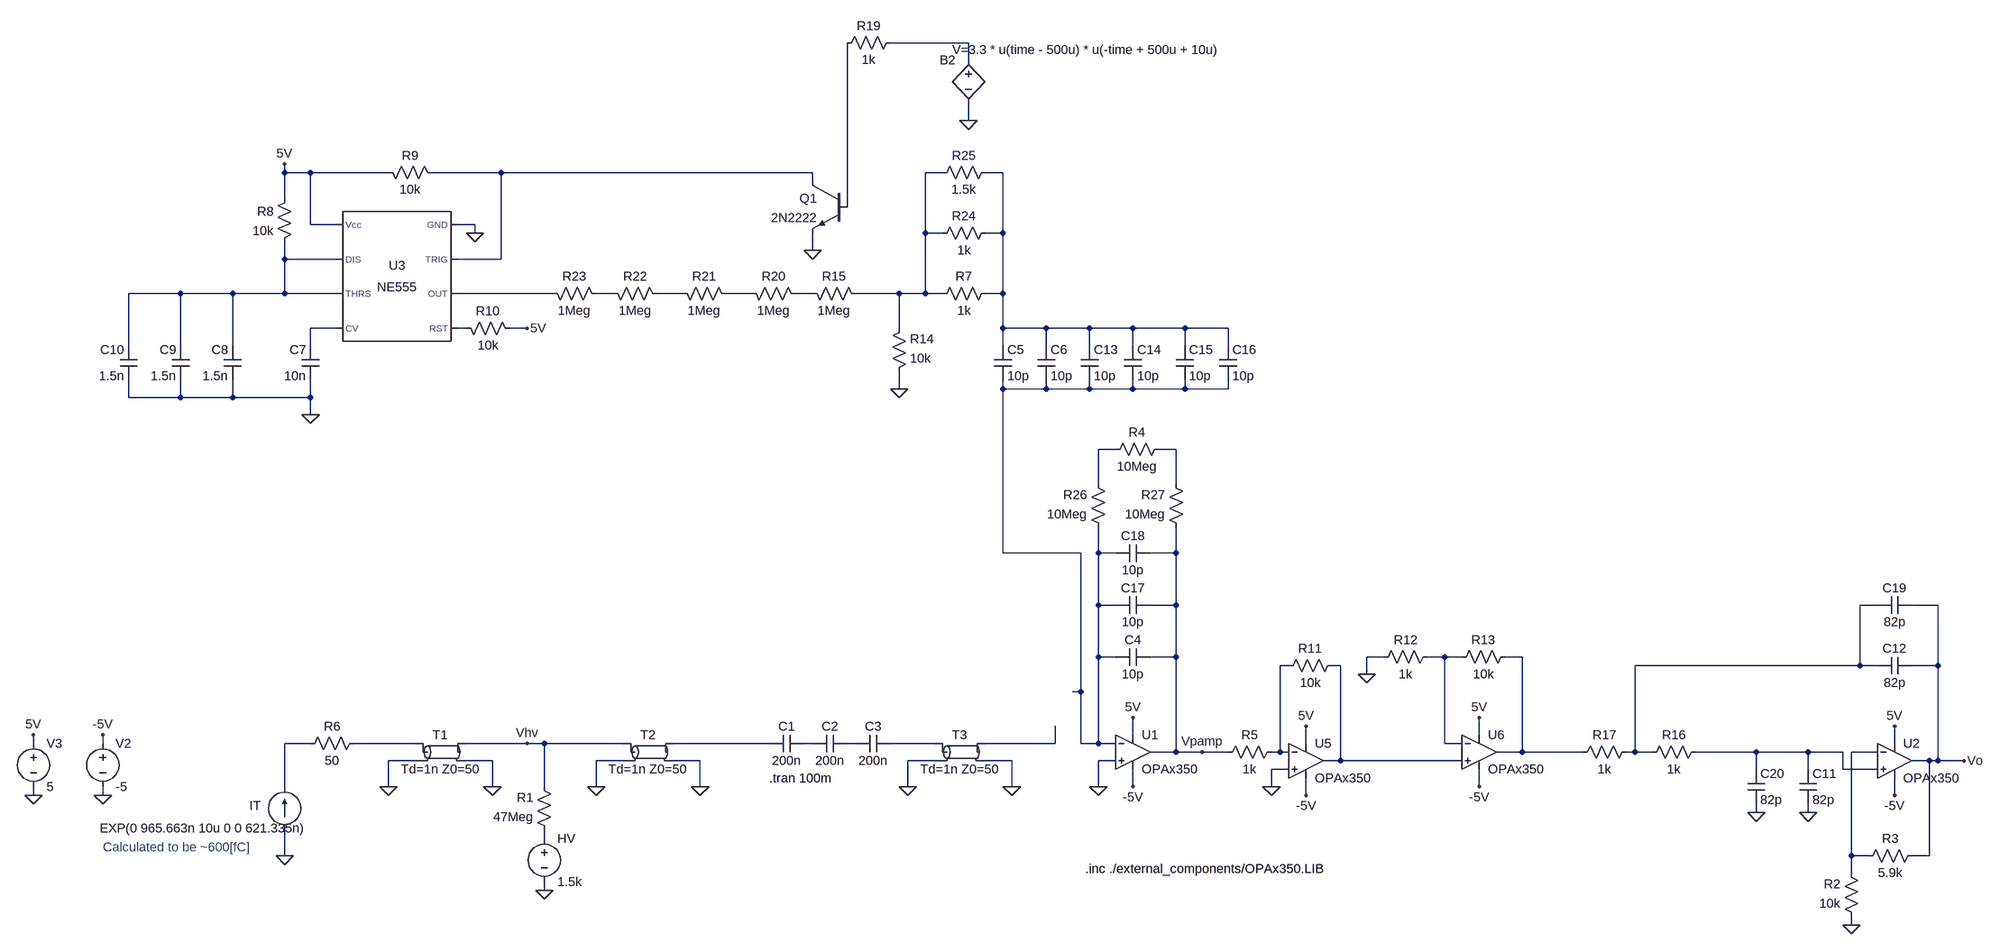
[diagram p0: schematic analog_section.asc]
analog_section.asc, the LTspice schematic file:
Version 4
SHEET 1 2996 820
WIRE 160 -1296 16 -1296
WIRE 160 -1264 160 -1296
WIRE 160 -1152 160 -1184
WIRE -1104 -1056 -1104 -1072
WIRE -1056 -1056 -1104 -1056
WIRE -912 -1056 -1056 -1056
WIRE -704 -1056 -832 -1056
WIRE -128 -1056 -704 -1056
WIRE 112 -1056 80 -1056
WIRE 224 -1056 192 -1056
WIRE -128 -1040 -128 -1056
WIRE -1104 -1008 -1104 -1056
WIRE -64 -992 -64 -1296
WIRE -1056 -960 -1056 -1056
WIRE -1008 -960 -1056 -960
WIRE -752 -960 -784 -960
WIRE -752 -944 -752 -960
WIRE 80 -944 80 -1056
WIRE 112 -944 80 -944
WIRE 224 -944 224 -1056
WIRE 224 -944 192 -944
WIRE -128 -912 -128 -944
WIRE -1104 -896 -1104 -928
WIRE -1008 -896 -1104 -896
WIRE -704 -896 -704 -1056
WIRE -704 -896 -784 -896
WIRE -1296 -832 -1392 -832
WIRE -1200 -832 -1296 -832
WIRE -1104 -832 -1104 -896
WIRE -1104 -832 -1200 -832
WIRE -1008 -832 -1104 -832
WIRE -608 -832 -784 -832
WIRE -496 -832 -528 -832
WIRE -368 -832 -416 -832
WIRE -240 -832 -288 -832
WIRE -128 -832 -160 -832
WIRE 32 -832 -48 -832
WIRE 80 -832 80 -944
WIRE 80 -832 32 -832
WIRE 112 -832 80 -832
WIRE 224 -832 224 -944
WIRE 224 -832 192 -832
WIRE -1008 -768 -1056 -768
WIRE -768 -768 -784 -768
WIRE -656 -768 -688 -768
WIRE 32 -768 32 -832
WIRE 224 -768 224 -832
WIRE 304 -768 224 -768
WIRE 384 -768 304 -768
WIRE 464 -768 384 -768
WIRE 560 -768 464 -768
WIRE 640 -768 560 -768
WIRE -1392 -736 -1392 -832
WIRE -1296 -736 -1296 -832
WIRE -1200 -736 -1200 -832
WIRE -1056 -736 -1056 -768
WIRE 224 -736 224 -768
WIRE 304 -736 304 -768
WIRE 384 -736 384 -768
WIRE 464 -736 464 -768
WIRE 560 -736 560 -768
WIRE 640 -736 640 -768
WIRE 32 -656 32 -688
WIRE 224 -656 224 -672
WIRE 304 -656 304 -672
WIRE 304 -656 224 -656
WIRE 384 -656 384 -672
WIRE 384 -656 304 -656
WIRE 464 -656 464 -672
WIRE 464 -656 384 -656
WIRE 560 -656 560 -672
WIRE 560 -656 464 -656
WIRE 640 -656 640 -672
WIRE 640 -656 560 -656
WIRE -1392 -640 -1392 -672
WIRE -1296 -640 -1296 -672
WIRE -1296 -640 -1392 -640
WIRE -1200 -640 -1200 -672
WIRE -1200 -640 -1296 -640
WIRE -1056 -640 -1056 -672
WIRE -1056 -640 -1200 -640
WIRE -1056 -608 -1056 -640
WIRE 432 -544 400 -544
WIRE 544 -544 512 -544
WIRE 400 -480 400 -544
WIRE 544 -480 544 -544
WIRE 224 -352 224 -656
WIRE 368 -352 224 -352
WIRE 400 -352 400 -400
WIRE 432 -352 400 -352
WIRE 544 -352 544 -400
WIRE 544 -352 496 -352
WIRE 400 -256 400 -352
WIRE 432 -256 400 -256
WIRE 544 -256 544 -352
WIRE 544 -256 496 -256
WIRE 1840 -256 1808 -256
WIRE 1952 -256 1904 -256
WIRE 400 -160 400 -256
WIRE 432 -160 400 -160
WIRE 544 -160 544 -256
WIRE 544 -160 496 -160
WIRE 928 -160 896 -160
WIRE 1040 -160 1008 -160
WIRE 1072 -160 1040 -160
WIRE 1184 -160 1152 -160
WIRE 752 -144 736 -144
WIRE 848 -144 832 -144
WIRE 1808 -144 1808 -256
WIRE 1808 -144 1392 -144
WIRE 1840 -144 1808 -144
WIRE 1952 -144 1952 -256
WIRE 1952 -144 1904 -144
WIRE 896 -128 896 -160
WIRE 368 -96 368 -352
WIRE 368 -96 352 -96
WIRE 464 -16 464 -48
WIRE 1104 -16 1104 -48
WIRE -1568 0 -1568 -16
WIRE -1440 0 -1440 -16
WIRE -1056 0 -1104 0
WIRE -864 0 -976 0
WIRE -656 0 -768 0
WIRE -624 0 -656 0
WIRE -480 0 -624 0
WIRE -208 0 -384 0
WIRE -128 0 -144 0
WIRE -48 0 -64 0
WIRE 96 0 16 0
WIRE 320 0 320 -32
WIRE 320 0 192 0
WIRE 368 0 368 -96
WIRE 400 0 400 -160
WIRE 400 0 368 0
WIRE 432 0 400 0
WIRE 784 0 784 -32
WIRE 1040 0 1040 -160
WIRE 1072 0 1040 0
WIRE 1872 0 1872 -32
WIRE 544 16 544 -160
WIRE 544 16 496 16
WIRE 592 16 544 16
WIRE 640 16 592 16
WIRE 736 16 736 -144
WIRE 736 16 720 16
WIRE 752 16 736 16
WIRE 1184 16 1184 -160
WIRE 1184 16 1136 16
WIRE 1296 16 1184 16
WIRE 1392 16 1392 -144
WIRE 1392 16 1376 16
WIRE 1424 16 1392 16
WIRE 1616 16 1504 16
WIRE 1712 16 1616 16
WIRE 1776 16 1712 16
WIRE 1840 16 1792 16
WIRE -864 32 -912 32
WIRE -720 32 -768 32
WIRE -480 32 -528 32
WIRE -336 32 -384 32
WIRE 96 32 48 32
WIRE 240 32 192 32
WIRE 432 32 400 32
WIRE 848 32 848 -144
WIRE 848 32 816 32
WIRE 1072 32 848 32
WIRE 1936 32 1904 32
WIRE 1952 32 1952 -144
WIRE 1952 32 1936 32
WIRE 2000 32 1952 32
WIRE 752 48 720 48
WIRE 1616 48 1616 16
WIRE 1712 48 1712 16
WIRE 1776 48 1776 16
WIRE 1840 48 1776 48
WIRE -1104 80 -1104 0
WIRE -912 80 -912 32
WIRE -720 80 -720 32
WIRE -624 80 -624 0
WIRE -528 80 -528 32
WIRE -336 80 -336 32
WIRE 48 80 48 32
WIRE 240 80 240 32
WIRE 400 80 400 32
WIRE 464 80 464 48
WIRE 720 80 720 48
WIRE 1104 80 1104 48
WIRE -1568 96 -1568 80
WIRE -1440 96 -1440 80
WIRE 784 96 784 64
WIRE 1872 96 1872 64
WIRE 1616 128 1616 112
WIRE 1712 128 1712 112
WIRE -624 176 -624 160
WIRE -1104 208 -1104 160
WIRE 1792 208 1792 16
WIRE 1824 208 1792 208
WIRE 1936 208 1936 32
WIRE 1936 208 1904 208
WIRE 1792 240 1792 208
WIRE -624 272 -624 256
WIRE 1792 336 1792 320
FLAG -624 272 0
FLAG -1104 208 0
FLAG -336 80 0
FLAG -528 80 0
FLAG -720 80 0
FLAG -912 80 0
FLAG 240 80 0
FLAG 48 80 0
FLAG -656 0 Vhv
FLAG 400 80 0
FLAG -1440 96 0
FLAG -1440 -16 -5V
FLAG 720 80 0
FLAG 896 -128 0
FLAG -1056 -608 0
FLAG -752 -944 0
FLAG -1104 -1072 5V
FLAG -656 -768 5V
FLAG -1568 96 0
FLAG -1568 -16 5V
FLAG 160 -1152 0
FLAG 32 -656 0
FLAG -128 -912 0
FLAG 592 16 Vpamp
FLAG 2000 32 Vo
FLAG 1792 336 0
FLAG 1712 128 0
FLAG 1616 128 0
FLAG 1104 -48 5V
FLAG 784 -32 5V
FLAG 464 -48 5V
FLAG 464 80 -5V
FLAG 784 96 -5V
FLAG 1104 80 -5V
FLAG 1872 96 -5V
FLAG 1872 -32 5V
SYMBOL voltage -624 160 R0
WINDOW 123 0 0 Left 0
WINDOW 39 0 0 Left 0
SYMATTR InstName HV
SYMATTR Value 1.5k
SYMBOL current -1104 160 R180
WINDOW 0 54 29 Top 2
WINDOW 3 151 19 Bottom 2
WINDOW 123 0 0 Left 0
WINDOW 39 0 0 Left 0
SYMATTR InstName IT
SYMATTR Value EXP(0 965.663n 10u 0 0 621.335n)
SYMBOL res -608 176 R180
WINDOW 0 36 76 Left 2
WINDOW 3 36 40 Left 2
SYMATTR InstName R1
SYMATTR Value 47Meg
SYMBOL cap 432 -144 R270
WINDOW 0 32 32 VTop 2
WINDOW 3 0 32 VBottom 2
SYMATTR InstName C4
SYMATTR Value 10p
SYMBOL cap -208 16 R270
WINDOW 0 32 32 VTop 2
WINDOW 3 0 32 VBottom 2
SYMATTR InstName C1
SYMATTR Value 200n
SYMBOL cap -128 16 R270
WINDOW 0 32 32 VTop 2
WINDOW 3 0 32 VBottom 2
SYMATTR InstName C2
SYMATTR Value 200n
SYMBOL cap -48 16 R270
WINDOW 0 32 32 VTop 2
WINDOW 3 0 32 VBottom 2
SYMATTR InstName C3
SYMATTR Value 200n
SYMBOL res -1072 16 R270
WINDOW 0 32 56 VTop 2
WINDOW 3 0 56 VBottom 2
SYMATTR InstName R6
SYMATTR Value 50
SYMBOL res 528 -560 R90
WINDOW 0 0 56 VBottom 2
WINDOW 3 32 56 VTop 2
SYMATTR InstName R4
SYMATTR Value 10Meg
SYMBOL OpAmps\\opamp2 464 -48 R0
SYMATTR InstName U1
SYMATTR Value OPAx350
SYMBOL voltage -1440 -16 R0
WINDOW 123 0 0 Left 0
WINDOW 39 0 0 Left 0
SYMATTR InstName V2
SYMATTR Value -5
SYMBOL OpAmps\\opamp2 784 -32 R0
SYMATTR InstName U5
SYMATTR Value OPAx350
SYMBOL res 624 32 R270
WINDOW 0 32 56 VTop 2
WINDOW 3 0 56 VBottom 2
SYMATTR InstName R5
SYMATTR Value 1k
SYMBOL res 736 -128 R270
WINDOW 0 32 56 VTop 2
WINDOW 3 0 56 VBottom 2
SYMATTR InstName R11
SYMATTR Value 10k
SYMBOL OpAmps\\opamp2 1104 -48 R0
SYMATTR InstName U6
SYMATTR Value OPAx350
SYMBOL res 912 -144 R270
WINDOW 0 32 56 VTop 2
WINDOW 3 0 56 VBottom 2
SYMATTR InstName R12
SYMATTR Value 1k
SYMBOL res 1056 -144 R270
WINDOW 0 32 56 VTop 2
WINDOW 3 0 56 VBottom 2
SYMATTR InstName R13
SYMATTR Value 10k
SYMBOL cap 208 -736 R0
SYMATTR InstName C5
SYMATTR Value 10p
SYMBOL res 96 -816 R270
WINDOW 0 32 56 VTop 2
WINDOW 3 0 56 VBottom 2
SYMATTR InstName R7
SYMATTR Value 1k
SYMBOL Misc\\NE555 -896 -864 M0
SYMATTR InstName U3
SYMBOL cap 288 -736 R0
SYMATTR InstName C6
SYMATTR Value 10p
SYMBOL res -1088 -1024 M0
SYMATTR InstName R8
SYMATTR Value 10k
SYMBOL cap -1040 -736 M0
SYMATTR InstName C7
SYMATTR Value 10n
SYMBOL cap -1184 -736 M0
SYMATTR InstName C8
SYMATTR Value 1.5n
SYMBOL res -928 -1072 M90
WINDOW 0 0 56 VBottom 2
WINDOW 3 32 56 VTop 2
SYMATTR InstName R9
SYMATTR Value 10k
SYMBOL res -784 -784 M90
WINDOW 0 0 56 VBottom 2
WINDOW 3 32 56 VTop 2
SYMATTR InstName R10
SYMATTR Value 10k
SYMBOL voltage -1568 -16 R0
WINDOW 123 0 0 Left 0
WINDOW 39 0 0 Left 0
SYMATTR InstName V3
SYMATTR Value 5
SYMBOL bv 160 -1280 M0
WINDOW 3 -465 -3 Left 2
SYMATTR Value V=3.3 * u(time - 500u) * u(-time + 500u + 10u)
SYMATTR InstName B2
SYMBOL res 16 -672 M180
WINDOW 0 36 76 Left 2
WINDOW 3 36 40 Left 2
SYMATTR InstName R14
SYMATTR Value 10k
SYMBOL res -144 -848 M90
WINDOW 0 0 56 VBottom 2
WINDOW 3 32 56 VTop 2
SYMATTR InstName R15
SYMATTR Value 1Meg
SYMBOL cap -1280 -736 M0
SYMATTR InstName C9
SYMATTR Value 1.5n
SYMBOL cap -1376 -736 M0
SYMATTR InstName C10
SYMATTR Value 1.5n
SYMBOL tline -816 16 R0
SYMATTR InstName T1
SYMATTR Value Td=1n Z0=50
SYMBOL tline -432 16 R0
SYMATTR InstName T2
SYMATTR Value Td=1n Z0=50
SYMBOL tline 144 16 R0
SYMATTR InstName T3
SYMATTR Value Td=1n Z0=50
SYMBOL res 1808 336 R180
WINDOW 0 36 76 Left 2
WINDOW 3 36 40 Left 2
SYMATTR InstName R2
SYMATTR Value 10k
SYMBOL res 1920 192 R90
WINDOW 0 0 56 VBottom 2
WINDOW 3 32 56 VTop 2
SYMATTR InstName R3
SYMATTR Value 5.9k
SYMBOL cap 1696 48 R0
SYMATTR InstName C11
SYMATTR Value 82p
SYMBOL cap 1840 -128 R270
WINDOW 0 32 32 VTop 2
WINDOW 3 0 32 VBottom 2
SYMATTR InstName C12
SYMATTR Value 82p
SYMBOL res 1408 32 R270
WINDOW 0 32 56 VTop 2
WINDOW 3 0 56 VBottom 2
SYMATTR InstName R16
SYMATTR Value 1k
SYMBOL res 1280 32 R270
WINDOW 0 32 56 VTop 2
WINDOW 3 0 56 VBottom 2
SYMATTR InstName R17
SYMATTR Value 1k
SYMBOL npn -64 -1040 M0
SYMATTR InstName Q1
SYMATTR Value 2N2222
SYMBOL res 32 -1312 R90
WINDOW 0 0 56 VBottom 2
WINDOW 3 32 56 VTop 2
SYMATTR InstName R19
SYMATTR Value 1k
SYMBOL OpAmps\\opamp2 1872 -32 R0
SYMATTR InstName U2
SYMATTR Value OPAx350
SYMBOL res -256 -848 M90
WINDOW 0 0 56 VBottom 2
WINDOW 3 32 56 VTop 2
SYMATTR InstName R20
SYMATTR Value 1Meg
SYMBOL res -384 -848 M90
WINDOW 0 0 56 VBottom 2
WINDOW 3 32 56 VTop 2
SYMATTR InstName R21
SYMATTR Value 1Meg
SYMBOL res -512 -848 M90
WINDOW 0 0 56 VBottom 2
WINDOW 3 32 56 VTop 2
SYMATTR InstName R22
SYMATTR Value 1Meg
SYMBOL res -624 -848 M90
WINDOW 0 0 56 VBottom 2
WINDOW 3 32 56 VTop 2
SYMATTR InstName R23
SYMATTR Value 1Meg
SYMBOL res 96 -928 R270
WINDOW 0 32 56 VTop 2
WINDOW 3 0 56 VBottom 2
SYMATTR InstName R24
SYMATTR Value 1k
SYMBOL res 96 -1040 R270
WINDOW 0 32 56 VTop 2
WINDOW 3 0 56 VBottom 2
SYMATTR InstName R25
SYMATTR Value 1.5k
SYMBOL cap 368 -736 R0
SYMATTR InstName C13
SYMATTR Value 10p
SYMBOL cap 448 -736 R0
SYMATTR InstName C14
SYMATTR Value 10p
SYMBOL cap 544 -736 R0
SYMATTR InstName C15
SYMATTR Value 10p
SYMBOL cap 624 -736 R0
SYMATTR InstName C16
SYMATTR Value 10p
SYMBOL cap 432 -240 R270
WINDOW 0 32 32 VTop 2
WINDOW 3 0 32 VBottom 2
SYMATTR InstName C17
SYMATTR Value 10p
SYMBOL cap 432 -336 R270
WINDOW 0 32 32 VTop 2
WINDOW 3 0 32 VBottom 2
SYMATTR InstName C18
SYMATTR Value 10p
SYMBOL res 416 -384 R180
WINDOW 0 36 76 Left 2
WINDOW 3 36 40 Left 2
SYMATTR InstName R26
SYMATTR Value 10Meg
SYMBOL res 560 -384 R180
WINDOW 0 36 76 Left 2
WINDOW 3 36 40 Left 2
SYMATTR InstName R27
SYMATTR Value 10Meg
SYMBOL cap 1840 -240 R270
WINDOW 0 32 32 VTop 2
WINDOW 3 0 32 VBottom 2
SYMATTR InstName C19
SYMATTR Value 82p
SYMBOL cap 1600 48 R0
SYMATTR InstName C20
SYMATTR Value 82p
TEXT -208 64 Left 2 !.tran 100m
TEXT -1440 192 Left 2 ;Calculated to be ~600[fC]
TEXT 376 232 Left 2 !.inc ./external_components/OPAx350.LIB

The netlist it stands for:
* analog_section.asc
V§HV N031 0 1.5k
IT 0 N022 EXP(0 965.663n 10u 0 0 621.335n)
R1 N031 Vhv 47Meg
C4 N014 Vpamp 10p
C1 N024 N025 200n
C2 N025 N026 200n
C3 N026 N027 200n
R6 N022 N023 50
R4 N016 N015 10Meg
XU1 0 N014 5V -5V Vpamp OPAx350  ; pins In+ In- V+ V- OUT
V2 -5V 0 -5
XU5 0 N020 5V -5V N021 OPAx350  ; pins In+ In- V+ V- OUT
R5 Vpamp N020 1k
R11 N020 N021 10k
XU6 N021 N018 5V -5V N019 OPAx350  ; pins In+ In- V+ V- OUT
R12 0 N018 1k
R13 N018 N019 10k
C5 N004 N014 10p
R7 N003 N004 1k
XU3 0 N002 N007 N013 N012 N006 N006 5V NE555  ; pins GND TRIG OUT RST CV THRS DIS Vcc
C6 N004 N014 10p
R8 5V N006 10k
C7 N012 0 10n
C8 N006 0 1.5n
R9 5V N002 10k
R10 N013 5V 10k
V3 5V 0 5
B2 N001 0 V=3.3 * u(time - 500u) * u(-time + 500u + 10u)
R14 0 N003 10k
R15 N011 N003 1Meg
C9 N006 0 1.5n
C10 N006 0 1.5n
T1 N023 0 Vhv 0 Td=1n Z0=50
T2 Vhv 0 N024 0 Td=1n Z0=50
T3 N027 0 N028 0 Td=1n Z0=50
R2 0 N030 10k
R3 Vo N030 5.9k
C11 N029 0 82p
C12 N017 Vo 82p
R16 N017 N029 1k
R17 N019 N017 1k
Q1 N002 N005 0 0 2N2222
R19 N001 N005 1k
XU2 N029 N030 5V -5V Vo OPAx350  ; pins In+ In- V+ V- OUT
R20 N010 N011 1Meg
R21 N009 N010 1Meg
R22 N008 N009 1Meg
R23 N007 N008 1Meg
R24 N003 N004 1k
R25 N003 N004 1.5k
C13 N004 N014 10p
C14 N004 N014 10p
C15 N004 N014 10p
C16 N004 N014 10p
C17 N014 Vpamp 10p
C18 N014 Vpamp 10p
R26 N014 N015 10Meg
R27 Vpamp N016 10Meg
C19 N017 Vo 82p
C20 N029 0 82p
.model NPN NPN
.model PNP PNP
.lib standard.bjt
.tran 100m
* Calculated to be ~600[fC]
.inc ./external_components/OPAx350.LIB
.lib NE555.sub
.backanno
.end